# Altium schematic sheet ECB02S2-Kit-V1.0.SchDoc
size A4
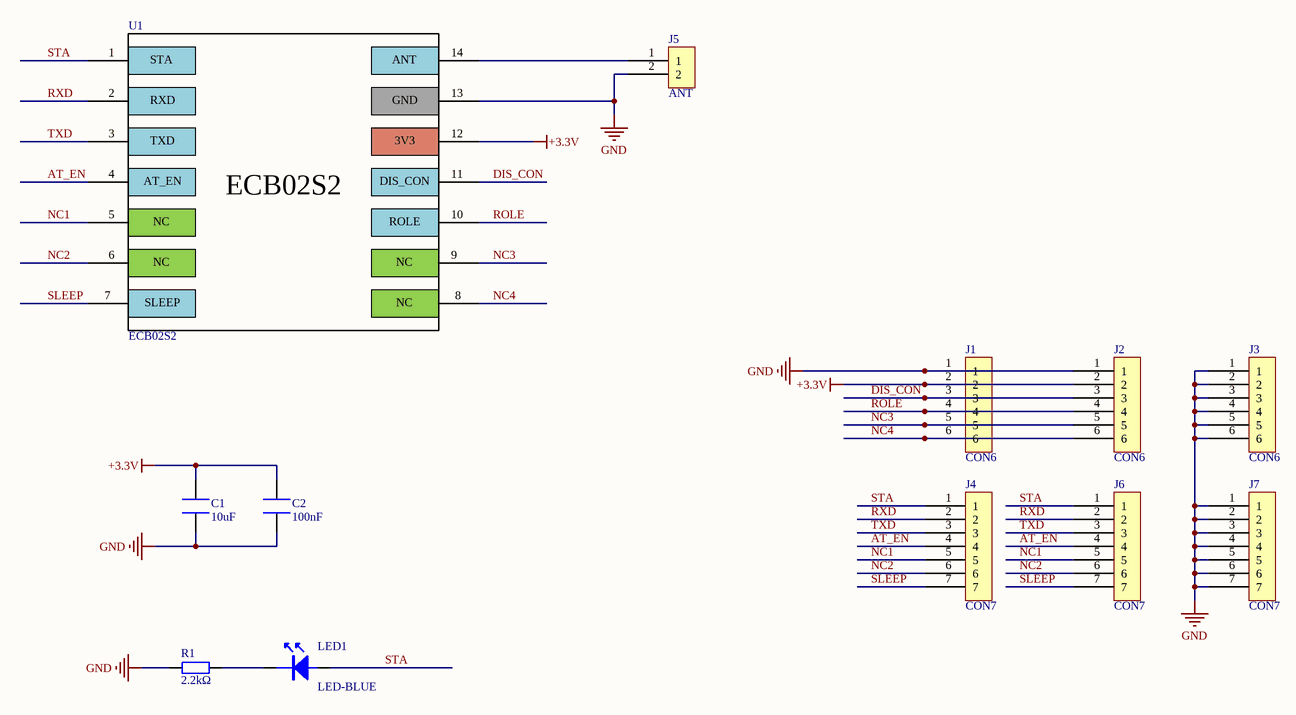
[diagram p0: ECB02S2-Kit-V1.0.SchDoc]

## Parts
C1  10uF  [0805]
C2  100nF  [0805]
J1  CON6  [SIP06]
J2  CON6  [SIP06]
J3  CON6  [SIP06]
J4  CON7  [SIP07]
J5  ANT  [ANT-2.4G-1]
J6  CON7  [SIP07]
J7  CON7  [SIP07]
LED1  LED-BLUE  [0603-led]
R1  2.2kΩ  [0603]
U1  ECB02S2  [ECB02S2]

## Nets
+3.3V: C1.2 C2.2 J1.2 J2.2 U1.12
GND: C1.1 C2.1 J1.1 J2.1 J3.1 J3.2 J3.3 J3.4 J3.5 J3.6 J5.2 J7.1 J7.2 J7.3 J7.4 J7.5 J7.6 J7.7 R1.2 U1.13
AT_EN: J4.4 J6.4 U1.4
DIS_CON: J1.3 J2.3 U1.11
NC1: J4.5 J6.5 U1.5
NC2: J4.6 J6.6 U1.6
NC3: J1.5 J2.5 U1.9
NC4: J1.6 J2.6 U1.8
ROLE: J1.4 J2.4 U1.10
RXD: J4.2 J6.2 U1.2
SLEEP: J4.7 J6.7 U1.7
STA: J4.1 J6.1 LED1.1 U1.1
TXD: J4.3 J6.3 U1.3
NetJ5_1: J5.1 U1.14
NetLED1_2: LED1.2 R1.1

## Notes on the sheet
- (in symbol ECB02S2) STA; ANT; RXD; GND; TXD; 3V3; AT_EN; DIS_CON; NC; ROLE; SLEEP

## Library data of the parts
C1 C2 = C: 类型: 电容; 封装: 0402; 参数规格: *; 厂家: *; 厂家料号: *
LED1 = LED-0402: 封装: 0402; 类型: LED; 厂家: *; 厂家料号: *; 参数规格: *; 参考价格: *; 编号: *; 备注: *
R1 = R: 类型: 电阻; 封装: 0402; 厂家: *; 厂家料号: *; 参数规格: *; 参考价格: *; 编号: *; 备注: *